# EAGLE design Mainboard (EAGLE 7.3.0)
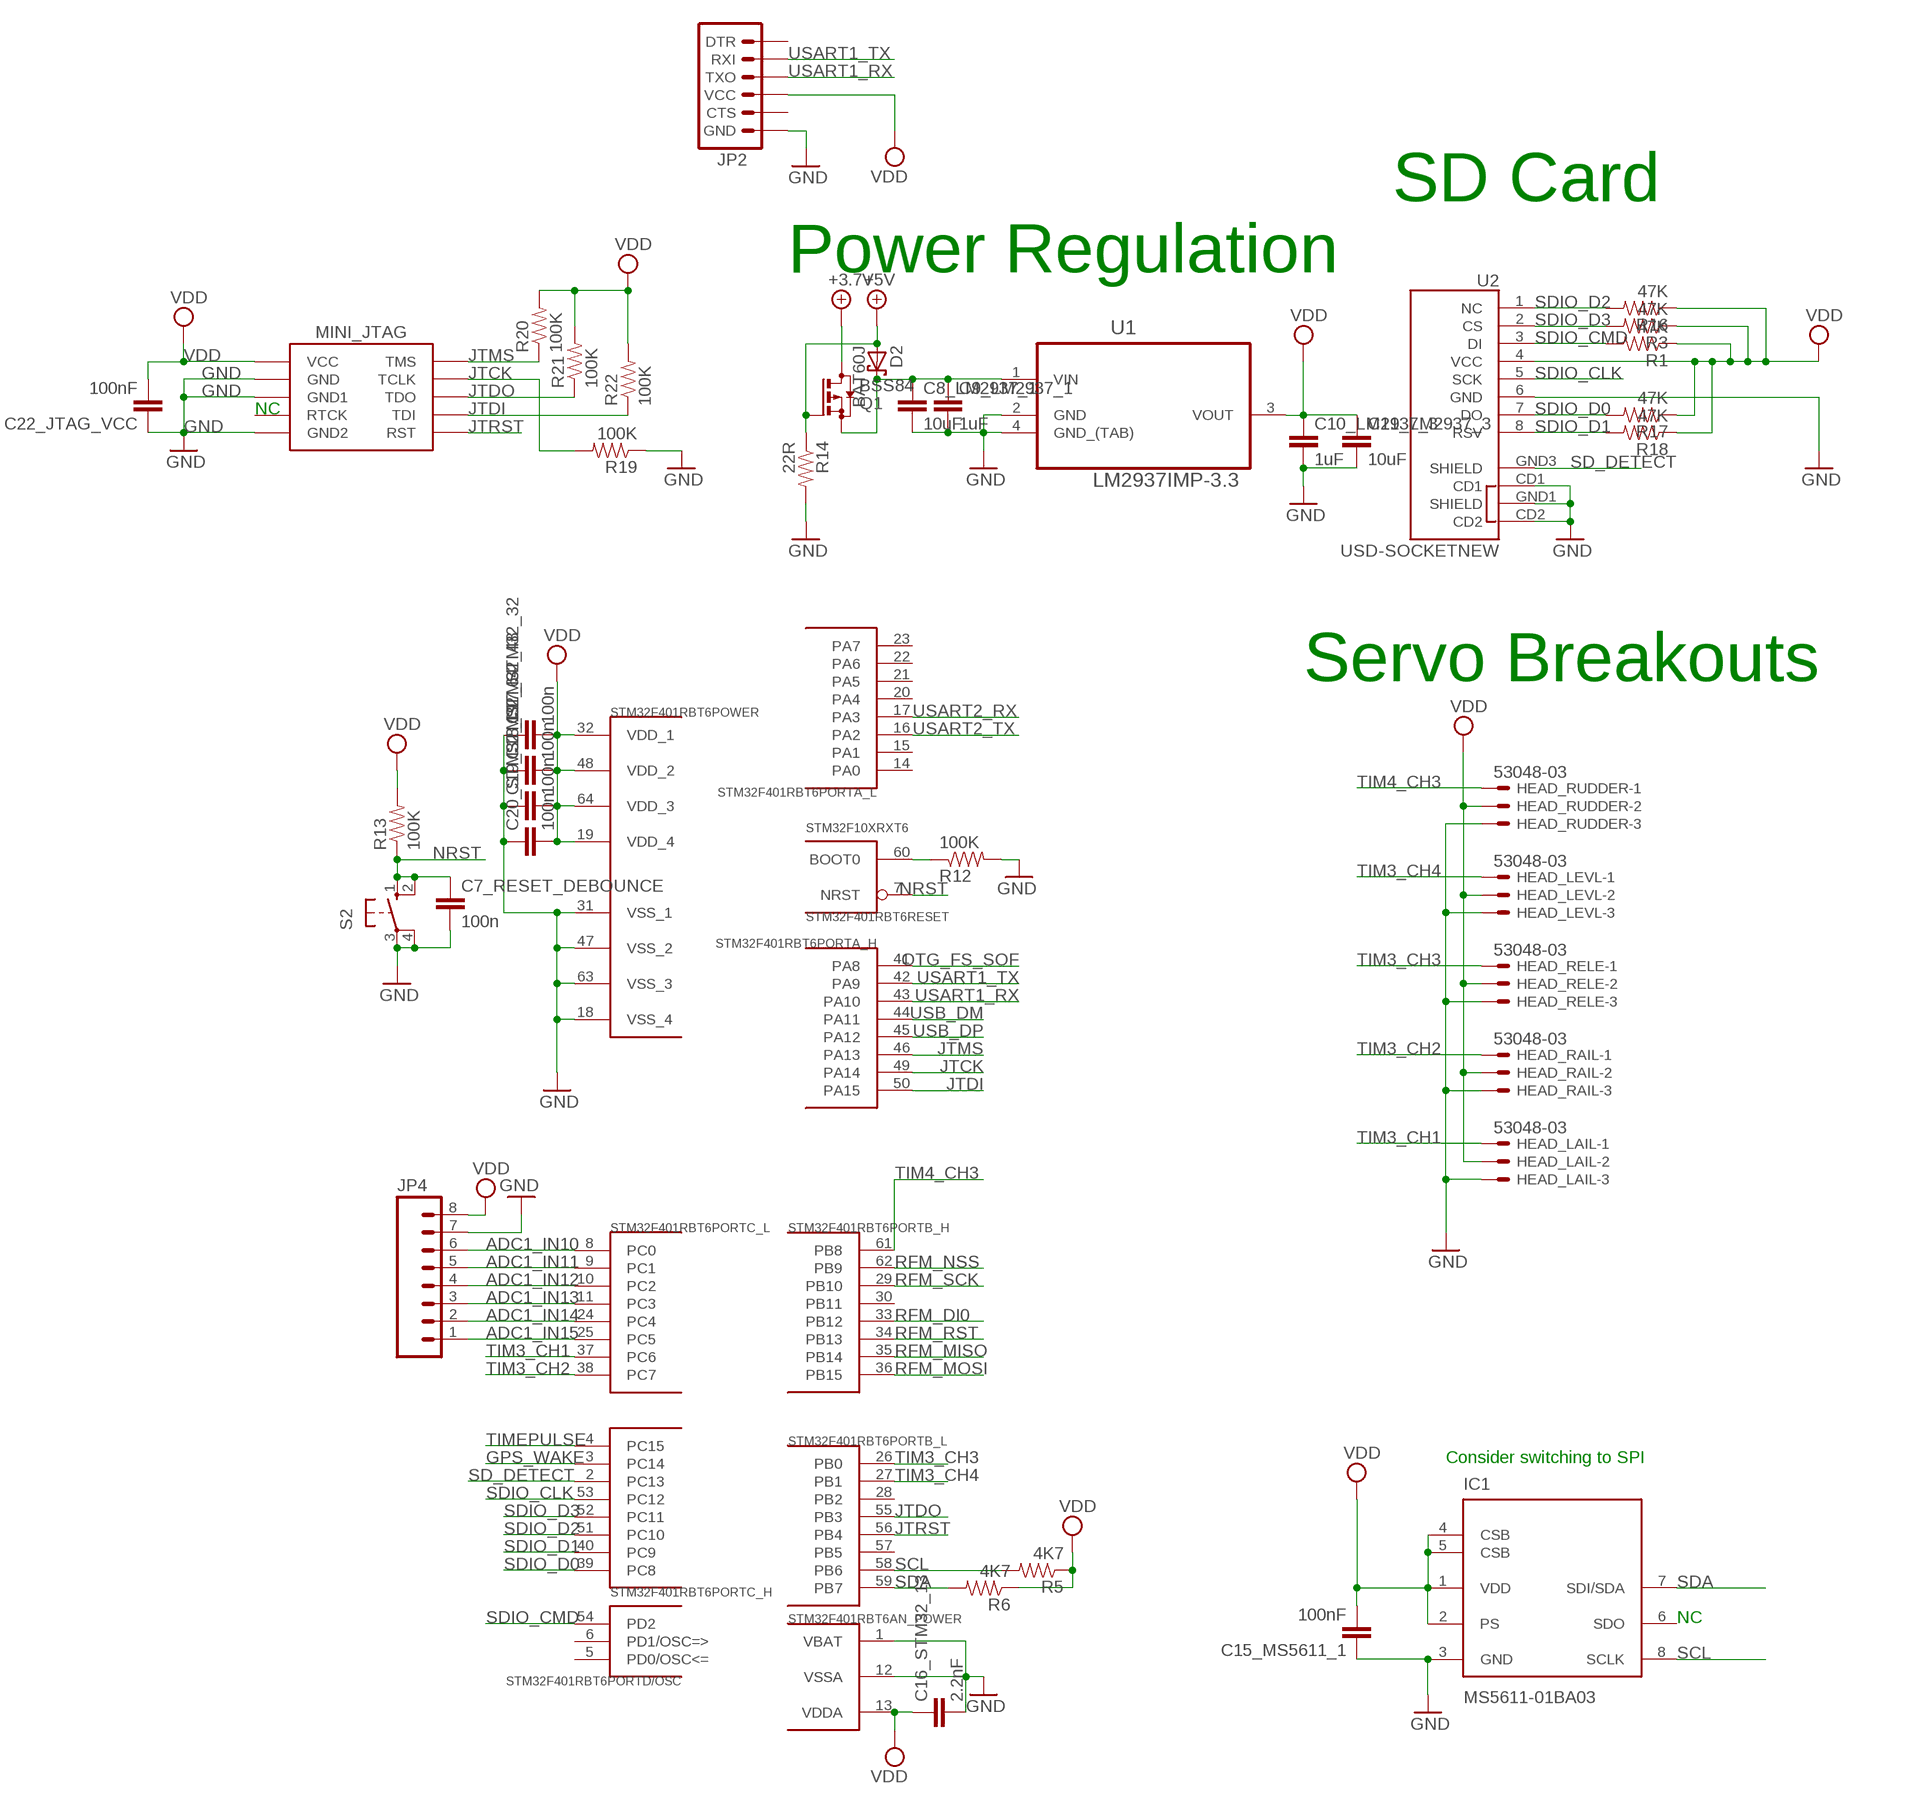
[diagram p0: schematic, sheet 1, part 1 of 2]
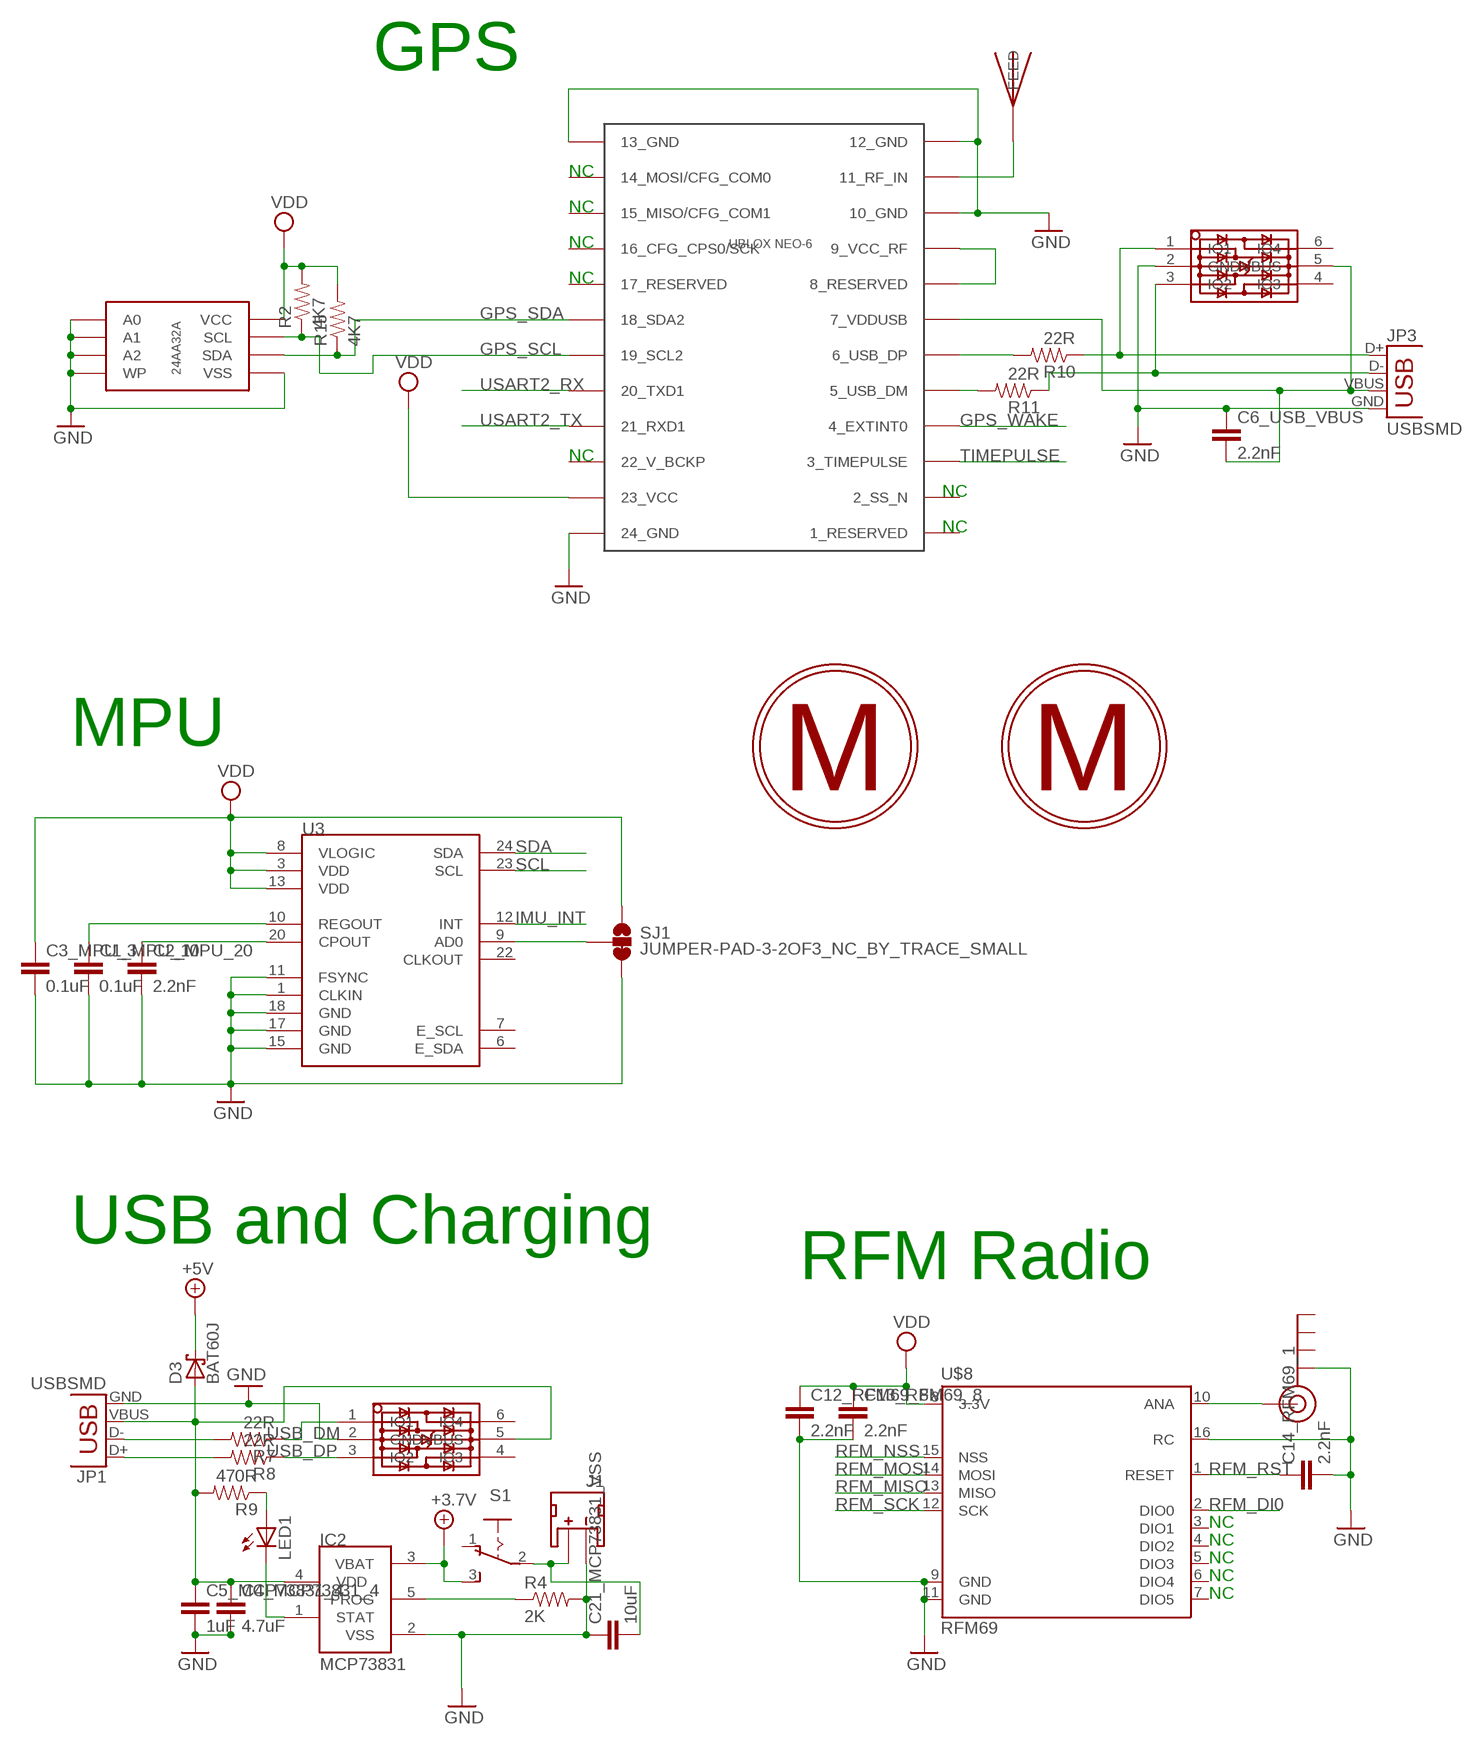
[diagram p1: schematic, sheet 1, part 2 of 2]

## Parts
C1_MPU_10  0.1uF  CAP0805  [0805]
C2_MPU_20  2.2nF  CAP0805  [0805]
C3_MPU_3  0.1uF  CAP0805  [0805]
C4_MCP73831_4  4.7uF  CAP0805  [0805]
C5_MCP73831_4  1uF  CAP0805  [0805]
C6_USB_VBUS  2.2nF  CAP0805  [0805]
C7_RESET_DEBOUNCE  100n  CAP0805  [0805]
C8_LM2937_1  10uF  CAP0805  [0805]
C9_LM2937_1  1uF  CAP0805  [0805]
C10_LM2937_3  1uF  CAP0805  [0805]
C11_LM2937_3  10uF  CAP0805  [0805]
C12_RFM69_8  2.2nF  CAP0805  [0805]
C13_RFM69_8  2.2nF  CAP0805  [0805]
C14_RFM69_1  2.2nF  CAP0805  [0805]
C15_MS5611_1  100nF  CAP0805  [0805]
C16_STM32_13  2.2nF  CAP0805  [0805]
C17_STM32_32  100n  CAP0805  [0805]
C18_STM32_48  100n  CAP0805  [0805]
C19_STM32_64  100n  CAP0805  [0805]
C20_STM32_19  100n  CAP0805  [0805]
C21_MCP73831_VSS  10uF  CAP0805  [0805]
C22_JTAG_VCC  100nF  CAP0805  [0805]
D2  BAT60J  [SOD323_ST]
D3  BAT60J  [SOD323_ST]
HEAD_LAIL  53048-03  [53048-03]
HEAD_LEVL  53048-03  [53048-03]
HEAD_RAIL  53048-03  [53048-03]
HEAD_RELE  53048-03  [53048-03]
HEAD_RUDDER  53048-03  [53048-03]
IC1  MS5611-01BA03  [SON125P300X500X100-8N]
IC2  MCP73831  [SOT23-5L]
J1  JST_2MM_MALE  [JST-2-SMD]
J$1  SMA_EDGE  [SMA-EDGE]
JP1  USBSMD  [USB-MINIB]
JP2  ARDUINO_SERIAL_PROGRAMSMD  [1X06-SMD]
JP3  USBSMD  [USB-MINIB]
JP4  M08BM08B-SRSS-TB  [BM08B-SRSS-TB]
LED1  LEDCHIP-LED0805  [CHIP-LED0805]
Q1  BSS84  [SOT23]
R1  47K  RESISTOR0805-RES  [0805]
R2  4K7  RESISTOR0805-RES  [0805]
R3  47K  RESISTOR0805-RES  [0805]
R4  2K  RESISTOR0805-RES  [0805]
R5  4K7  RESISTOR0805-RES  [0805]
R6  4K7  RESISTOR0805-RES  [0805]
R7  22R  RESISTOR0805-RES  [0805]
R8  22R  RESISTOR0805-RES  [0805]
R9  470R  RESISTOR0805-RES  [0805]
R10  22R  RESISTOR0805-RES  [0805]
R11  22R  RESISTOR0805-RES  [0805]
R12  100K  RESISTOR0805-RES  [0805]
R13  100K  RESISTOR0805-RES  [0805]
R14  22R  RESISTOR0805-RES  [0805]
R15  4K7  RESISTOR0805-RES  [0805]
R16  47K  RESISTOR0805-RES  [0805]
R17  47K  RESISTOR0805-RES  [0805]
R18  47K  RESISTOR0805-RES  [0805]
R19  100K  RESISTOR0805-RES  [0805]
R20  100K  RESISTOR0805-RES  [0805]
R21  100K  RESISTOR0805-RES  [0805]
R22  100K  RESISTOR0805-RES  [0805]
S1  255SB  [255SB]
S2  10-XX  [B3F-10XX]
SJ1  JUMPER-PAD-3-2OF3_NC_BY_TRACE_SMALL  [PAD-JUMPER-3-2OF3_NC_BY_TRACE_YES_SILK_FULL_BOX]
STM32F401RBT6  STM32F10XRXT6  [TQFP64]
U1  LM2937IMP-3.3  LM2937IMP-5.0  [SOT230P700X180-4N]
U2  USD-SOCKETNEW  [MICRO-SD-SOCKET-PP]
U3  MPU-9150QFN-24-NP  [QFN-24-NP]
U$1  USBLC6-4  [SOT23-6]
U$2  JTAG_MINI  [JTAG_MINI]
U$3  I2C_EEPROM_24AA32A  [MSOP8]
U$4  JTI_ANTENNA-1575AT43A40  [JTI_ANTENNA-1575AT43A40]
U$5  UBLOX_NEO-6  [UBLOX_NEO-6P]
U$6  USBLC6-4  [SOT23-6]
U$7  SERVO  [HK3D-1.7L]
U$8  RFM69  [RFM69SMD]
U$9  SERVO  [HK3D-1.7L]

## Nets
+4.1V: IC2.3(VBAT) Q1.3(D) S1.3(S) ; supply symbol labelled +3.7V
+5V: D2.A D3.C Q1.1(G) R14.1
ADC1_IN10: JP4.6 STM32F401RBT6.8(PORTC_L:PC0)
ADC1_IN11: JP4.5 STM32F401RBT6.9(PORTC_L:PC1)
ADC1_IN12: JP4.4 STM32F401RBT6.10(PORTC_L:PC2)
ADC1_IN13: JP4.3 STM32F401RBT6.11(PORTC_L:PC3)
ADC1_IN14: JP4.2 STM32F401RBT6.24(PORTC_L:PC4)
ADC1_IN15: JP4.1 STM32F401RBT6.25(PORTC_L:PC5)
GND: C1_MPU_10.2 C2_MPU_20.2 C3_MPU_3.2 C4_MCP73831_4.2 C5_MCP73831_4.2 C6_USB_VBUS.1 C7_RESET_DEBOUNCE.2 C8_LM2937_1.2 C9_LM2937_1.2 C10_LM2937_3.2 C11_LM2937_3.2 C12_RFM69_8.2 C13_RFM69_8.2 C14_RFM69_1.2 C15_MS5611_1.1 C16_STM32_13.2 C17_STM32_32.1 C18_STM32_48.1 C19_STM32_64.1 C20_STM32_19.1 C21_MCP73831_VSS.1 C22_JTAG_VCC.1 HEAD_LAIL.3 HEAD_LEVL.3 HEAD_RAIL.3 HEAD_RELE.3 HEAD_RUDDER.3 IC1.3(GND) IC2.2(VSS) J1.1(-) J$1.GND@0(GND) JP1.GND JP2.6(GND) JP3.GND JP4.7 R4.2 R12.2 R14.2 R19.1 S2.3(P) S2.4(P1) SJ1.3 STM32F401RBT6.1(AN_POWER:VBAT) STM32F401RBT6.12(AN_POWER:VSSA) STM32F401RBT6.18(POWER:VSS_4) STM32F401RBT6.31(POWER:VSS_1) STM32F401RBT6.47(POWER:VSS_2) STM32F401RBT6.63(POWER:VSS_3) U1.2(GND) U1.4(GND_(TAB)) U2.6(GND) U2.CD1 U2.CD2 U2.GND1(SHIELD) U3.1(CLKIN) U3.11(FSYNC) U3.15(GND) U3.17(GND) U3.18(GND) U$1.2(GND) U$2.3(GND) U$2.5(GND1) U$2.9(GND2) U$3.1(A0) U$3.2(A1) U$3.3(A2) U$3.4(VSS) U$3.7(WP) U$5.10_GND U$5.12_GND U$5.13_GND U$5.24_GND U$6.2(GND) U$8.9(GND) U$8.11(GND) U$8.16(RC)
GPS_SCL: R2.1 U$3.6(SCL) U$5.19_SCL2
GPS_SDA: R15.1 U$3.5(SDA) U$5.18_SDA2
GPS_WAKE: STM32F401RBT6.3(PORTC_H:PC14) U$5.4_EXTINT0
IMU_INT: U3.12(INT)
JTCK: R19.2 STM32F401RBT6.49(PORTA_H:PA14) U$2.4(TCLK)
JTDI: R22.1 STM32F401RBT6.50(PORTA_H:PA15) U$2.8(TDI)
JTDO: R21.1 STM32F401RBT6.55(PORTB_L:PB3) U$2.6(TDO)
JTMS: R20.1 STM32F401RBT6.46(PORTA_H:PA13) U$2.2(TMS)
JTRST: STM32F401RBT6.56(PORTB_L:PB4) U$2.10(RST)
N$1: C4_MCP73831_4.1 C5_MCP73831_4.1 D3.A IC2.4(VDD) JP1.VBUS R9.2 U$6.5(VBUS)
N$2: C21_MCP73831_VSS.2 J1.2(+) S1.2(P)
N$5: J$1.SIG(SIGNAL) U$8.10(ANA)
N$13: C8_LM2937_1.1 C9_LM2937_1.1 D2.C Q1.2(S) U1.1(VIN)
N$14: U$4.FEED U$5.11_RF_IN
N$15: SJ1.2 U3.9(AD0)
N$16: JP1.D+ R8.2
N$17: JP1.D- R7.2
N$18: C1_MPU_10.1 U3.10(REGOUT)
N$19: IC2.5(PROG) R4.1
N$21: C2_MPU_20.1 U3.20(CPOUT)
N$22: LED1.A R9.1
N$23: IC2.1(STAT) LED1.C
N$24: JP3.D+ R10.1 U$1.1(IO1)
N$25: JP3.D- R11.1 U$1.3(IO2)
N$26: R10.2 U$5.6_USB_DP
N$27: R11.2 U$5.5_USB_DM
N$28: C6_USB_VBUS.2 JP3.VBUS U$1.5(VBUS) U$5.7_VDDUSB
N$30: U$5.8_RESERVED U$5.9_VCC_RF
N$31: R12.1 STM32F401RBT6.60(RESET:BOOT0)
NRST: C7_RESET_DEBOUNCE.1 R13.1 S2.1(S) S2.2(S1) STM32F401RBT6.7(RESET:NRST)
OTG_FS_SOF: STM32F401RBT6.41(PORTA_H:PA8)
RFM_DI0: STM32F401RBT6.33(PORTB_H:PB12) U$8.2(DIO0)
RFM_MISO: STM32F401RBT6.35(PORTB_H:PB14) U$8.13(MISO)
RFM_MOSI: STM32F401RBT6.36(PORTB_H:PB15) U$8.14(MOSI)
RFM_NSS: STM32F401RBT6.62(PORTB_H:PB9) U$8.15(NSS)
RFM_RST: C14_RFM69_1.1 STM32F401RBT6.34(PORTB_H:PB13) U$8.1(RESET)
RFM_SCK: STM32F401RBT6.29(PORTB_H:PB10) U$8.12(SCK)
SCL: IC1.8(SCLK) R5.2 STM32F401RBT6.58(PORTB_L:PB6) U3.23(SCL)
SD_DETECT: STM32F401RBT6.2(PORTC_H:PC13) U2.GND3(SHIELD)
SDA: IC1.7(SDI/SDA) R6.2 STM32F401RBT6.59(PORTB_L:PB7) U3.24(SDA)
SDIO_CLK: STM32F401RBT6.53(PORTC_H:PC12) U2.5(SCK)
SDIO_CMD: R1.2 STM32F401RBT6.54(PORTD/OSC:PD2) U2.3(DI)
SDIO_D0: R17.2 STM32F401RBT6.39(PORTC_H:PC8) U2.7(DO)
SDIO_D1: R18.2 STM32F401RBT6.40(PORTC_H:PC9) U2.8(RSV)
SDIO_D2: R16.2 STM32F401RBT6.51(PORTC_H:PC10) U2.1(NC)
SDIO_D3: R3.2 STM32F401RBT6.52(PORTC_H:PC11) U2.2(CS)
TIM3_CH1: HEAD_LAIL.1 STM32F401RBT6.37(PORTC_L:PC6)
TIM3_CH2: HEAD_RAIL.1 STM32F401RBT6.38(PORTC_L:PC7)
TIM3_CH3: HEAD_RELE.1 STM32F401RBT6.26(PORTB_L:PB0)
TIM3_CH4: HEAD_LEVL.1 STM32F401RBT6.27(PORTB_L:PB1)
TIM4_CH3: HEAD_RUDDER.1 STM32F401RBT6.61(PORTB_H:PB8)
TIMEPULSE: STM32F401RBT6.4(PORTC_H:PC15) U$5.3_TIMEPULSE
USART1_RX: JP2.3(TXO) STM32F401RBT6.43(PORTA_H:PA10)
USART1_TX: JP2.2(RXI) STM32F401RBT6.42(PORTA_H:PA9)
USART2_RX: STM32F401RBT6.17(PORTA_L:PA3) U$5.20_TXD1
USART2_TX: STM32F401RBT6.16(PORTA_L:PA2) U$5.21_RXD1
USB_DM: R7.1 STM32F401RBT6.44(PORTA_H:PA11) U$6.1(IO1)
USB_DP: R8.1 STM32F401RBT6.45(PORTA_H:PA12) U$6.3(IO2)
VDD: C3_MPU_3.1 C10_LM2937_3.1 C11_LM2937_3.1 C12_RFM69_8.1 C13_RFM69_8.1 C15_MS5611_1.2 C16_STM32_13.1 C17_STM32_32.2 C18_STM32_48.2 C19_STM32_64.2 C20_STM32_19.2 C22_JTAG_VCC.2 HEAD_LAIL.2 HEAD_LEVL.2 HEAD_RAIL.2 HEAD_RELE.2 HEAD_RUDDER.2 IC1.1(VDD) IC1.2(PS) IC1.4(CSB) IC1.5(CSB) JP2.4(VCC) JP4.8 R1.1 R2.2 R3.1 R5.1 R6.1 R13.2 R15.2 R16.1 R17.1 R18.1 R20.2 R21.2 R22.2 SJ1.1 STM32F401RBT6.13(AN_POWER:VDDA) STM32F401RBT6.19(POWER:VDD_4) STM32F401RBT6.32(POWER:VDD_1) STM32F401RBT6.48(POWER:VDD_2) STM32F401RBT6.64(POWER:VDD_3) U1.3(VOUT) U2.4(VCC) U3.3(VDD) U3.8(VLOGIC) U3.13(VDD) U$2.1(VCC) U$3.8(VCC) U$5.23_VCC U$8.8(3.3V)
Unconnected: IC1.6(SDO) J1.NC1(PAD1) J1.NC2(PAD2) J$1.GND@1(GND) J$1.GND@2(GND) J$1.GND@3(GND) JP2.1(DTR) JP2.5(CTS) S1.1(O) STM32F401RBT6.5(PORTD/OSC:PD0/OSC<=) STM32F401RBT6.6(PORTD/OSC:PD1/OSC=>) STM32F401RBT6.14(PORTA_L:PA0) STM32F401RBT6.15(PORTA_L:PA1) STM32F401RBT6.20(PORTA_L:PA4) STM32F401RBT6.21(PORTA_L:PA5) STM32F401RBT6.22(PORTA_L:PA6) STM32F401RBT6.23(PORTA_L:PA7) STM32F401RBT6.28(PORTB_L:PB2) STM32F401RBT6.30(PORTB_H:PB11) STM32F401RBT6.57(PORTB_L:PB5) U3.6(E_SDA) U3.7(E_SCL) U3.22(CLKOUT) U$1.4(IO3) U$1.6(IO4) U$2.7(RTCK) U$5.1_RESERVED U$5.2_SS_N U$5.14_MOSI/CFG_COM0 U$5.15_MISO/CFG_COM1 U$5.16_CFG_CPS0/SCK U$5.17_RESERVED U$5.22_V_BCKP U$6.4(IO3) U$6.6(IO4) U$8.3(DIO1) U$8.4(DIO2) U$8.5(DIO3) U$8.6(DIO4) U$8.7(DIO5)

## Notes on the sheet
- GPS
- NC
- SD Card
- NC
- NC
- Power Regulation
- NC
- NC
- NC
- NC
- NC
- Servo Breakouts
- MPU
- USB and Charging
- RFM Radio
- Consider switching to SPI
- NC
- NC
- NC
- NC
- NC
- NC

## Library data of the parts
C1_MPU_10 C2_MPU_20 C3_MPU_3 C4_MCP73831_4 C5_MCP73831_4 C6_USB_VBUS C7_RESET_DEBOUNCE C8_LM2937_1 C9_LM2937_1 C10_LM2937_3 C11_LM2937_3 C12_RFM69_8 C13_RFM69_8 C14_RFM69_1 C15_MS5611_1 C16_STM32_13 C17_STM32_32 C18_STM32_48 C19_STM32_64 C20_STM32_19 C21_MCP73831_VSS C22_JTAG_VCC = SparkFun-Capacitors:CAP: Capacitor Standard 0603 ceramic capacitor, and 0.1" leaded capacitor.
D2 D3 = diode:BAT60J: Schottky barrier diode Source: www.st.com, BAT60J.pdf
HEAD_LAIL HEAD_LEVL HEAD_RAIL HEAD_RELE HEAD_RUDDER = con-molex:53?-03: CONNECTOR wire to board 1.25 mm (.049 inch) pitch header; MF: WALDOM/MOLEX; MPN: 53048-0310; OC_FARNELL: 9732918; OC_NEWARK: 38C9908
IC1 = Measurement-Specialties:MS5611-01BA03: Variometer Module, with stainless steel cap
IC2 = microchip-update-2:MCP73831: Miniature Single-Cell, Fully Integrated Li-Ion, Li-Polymer Charge Management Controllers
J1 = SparkFun-Connectors:JST_2MM_MALE: Mates to single-cell LiPo batteries. CONN-11443 Now with smashable polarity marks!; BTM_NEG: -; BTM_POS: +; PROD_ID: CONN-11443; TOP_NEG: -; TOP_POS: +
J$1 = SparkFun-Connectors:SMA_EDGE: SMA Antenna Connector End launch SMA connector. The paste layer has been removed so that the connector can be hand soldered onto the board after reflow.
JP1 JP3 = SparkFun-Connectors:USB: USB Connectors USB-B-PTH is fully proven SKU : PRT-00139/CONN-08278 USB-miniB is fully proven SKU : PRT-00587 USB-A-PCB is untested. USB-A-H is throughly reviewed, but untested. Spark Fun Electronics SKU : PRT-00437 USB-B-SMT is throughly reviewed, but untested. Needs silkscreen touching up. USB-A-S has not been used/tested USB-MB-H has not been used/tested USB-MICROB has been used. CONN-09505; PROD_ID: CONN-08193
JP2 = SparkFun-Connectors:ARDUINO_SERIAL_PROGRAM: FTDI connector footprints; PROD_ID: CONN-08971
JP4 = SparkFun-Connectors:M08: Header 8 Standard 8-pin 0.1" header. Use with straight break away headers (SKU : PRT-00116), right angle break away headers (PRT-00553), swiss pins (PRT-00743), machine pins (PRT-00117), and female headers (PRT-00115).
LED1 = led:LED: LED OSRAM: - CHIPLED LG R971, LG N971, LY N971, LG Q971, LY Q971, LO R971, LY R971 LH N974, LH R974 LS Q976, LO Q976, LY Q976 LO Q996 - Hyper CHIPLED LW Q18S LB Q993, LB Q99A, LB R99A - SideLED LS A670, LO A670, LY A670, LG A670, LP A670 LB A673, LV A673, LT A673, LW A673 LH A674 LY A675 LS A676, LA A676, LO A676, LY A676, LW A676 LS A679, LY A679, LG A679 - Hyper Micro SIDELED® LS Y876, LA Y876, LO Y876, LY Y876 LT Y87S - SmartLED LW L88C, LW L88S LB L89C, LB L89S, LG L890 LS L89K, LO L89K, LY L89K LS L896, LA L896, LO L896, LY L896 - TOPLED LS T670, LO T670, LY T670, LG T670, LP T670 LSG T670, LSP T670, LSY T670, LOP T670, LYG T670 LG T671, LOG T671, LSG T671 LB T673, LV T673, LT T673, LW T673 LH T674 LS T676, LA T676, LO T676, LY T676, LB T676, LH T676, LSB T676, LW T676 LB T67C, LV T67C, LT T67C, LS T67K, LO T67K, LY T67K, LW E67C LS E67B, LA E67B, LO E67B, LY E67B, LB E67C, LV E67C, LT E67C LW T67C LS T679, LY T679, LG T679 LS T770, LO T770, LY T770, LG T770, LP T770 LB T773, LV T773, LT T773, LW T773 LH T774 LS E675, LA E675, LY E675, LS T675 LS T776, LA T776, LO T776, LY T776, LB T776 LHGB T686 LT T68C, LB T68C - Hyper Mini TOPLED® LB M676 - Mini TOPLED Santana® LG M470 LS M47K, LO M47K, LY M47K Source: http://www.osram.convergy.de LUXEON: - LUMILED® LXK2-PW12-R00, LXK2-PW12-S00, LXK2-PW14-U00, LXK2-PW14-V00 LXK2-PM12-R00, LXK2-PM12-S00, LXK2-PM14-U00 LXK2-PE12-Q00, LXK2-PE12-R00, LXK2-PE12-S00, LXK2-PE14-T00, LXK2-PE14-U00 LXK2-PB12-K00, LXK2-PB12-L00, LXK2-PB12-M00, LXK2-PB14-N00, LXK2-PB14-P00, LXK2-PB14-Q00 LXK2-PR12-L00, LXK2-PR12-M00, LXK2-PR14-Q00, LXK2-PR14-R00 LXK2-PD12-Q00, LXK2-PD12-R00, LXK2-PD12-S00 LXK2-PH12-R00, LXK2-PH12-S00 LXK2-PL12-P00, LXK2-PL12-Q00, LXK2-PL12-R00 Source: www.luxeon.com KINGBRIGHT: KA-3528ASYC Source: www.kingbright.com
Q1 = transistor-small-signal:BSS84: P-CHANNEL MOS FET
R1-R22 = SparkFun-Passives:RESISTOR: Resistor Basic schematic elements and footprints for 0603, 1206, and PTH resistors.
S1 = switch:255SB: SLIDING SWITCH Distributor Buerklin, 11G810
S2 = switch-omron:10-XX: OMRON SWITCH; MPN: B3F-1000; OC_FARNELL: 176432; OC_NEWARK: 36M3542
SJ1 = SparkFun-Passives:JUMPER-PAD-3-2OF3_NC_BY_TRACE
STM32F401RBT6 = stm32:STM32F10XRXT6: STM32F101/103 64pin LQFP
U1 = Ava:LM2937IMP-5.0: IC, LDO VOLT REG, 5V, 0.5A; MPN: LM2937IMP-5.0; OC_FARNELL: 1798318; OC_NEWARK: 83F3856; PACKAGE: SOT-223-3; SUPPLIER: Microchip
U2 = SparkFun-Connectors:USD-SOCKET: microSD Socket Push-push type uSD socket. Schematic element and footprint production proven. Spark Fun Electronics SKU : PRT-00127. tDoc lines correctly indicate media card edge positions when inserting (unlocked, locked, depressed). NOTE: CD1 and CD2 are connected internally; PROD_ID: CONN-07820
U3 = SparkFun-Sensors:MPU-9150: 9DOF (3mag, 3accel, 3rotat). I2C interface.
U$1 U$6 = zetex:USBLC6-4
U$2 = jonsowman:JTAG_MINI
U$3 = jonsowman:I2C_EEPROM_24AA32A
U$4 = Ava:JTI_ANTENNA-1575AT43A40
U$5 = Ava:UBLOX_NEO-6: UBLOX NEO-6 GPS MODULE Author Anthony Stirk / http://ava.upuaut.net http://www.u-blox.com/images/downloads/Product_Docs/LEA-6_NEO-6_MAX_HardwareIntegrationManual_%28GPS.G6-HW-09007%29.pdf http://www.u-blox.com/images/downloads/Product_Docs/NEO-6_DataSheet_%28GPS.G6-HW-09005%29.pdf
U$7 U$9 = b3noxley:SERVO
U$8 = SWP:RFM69

## Board
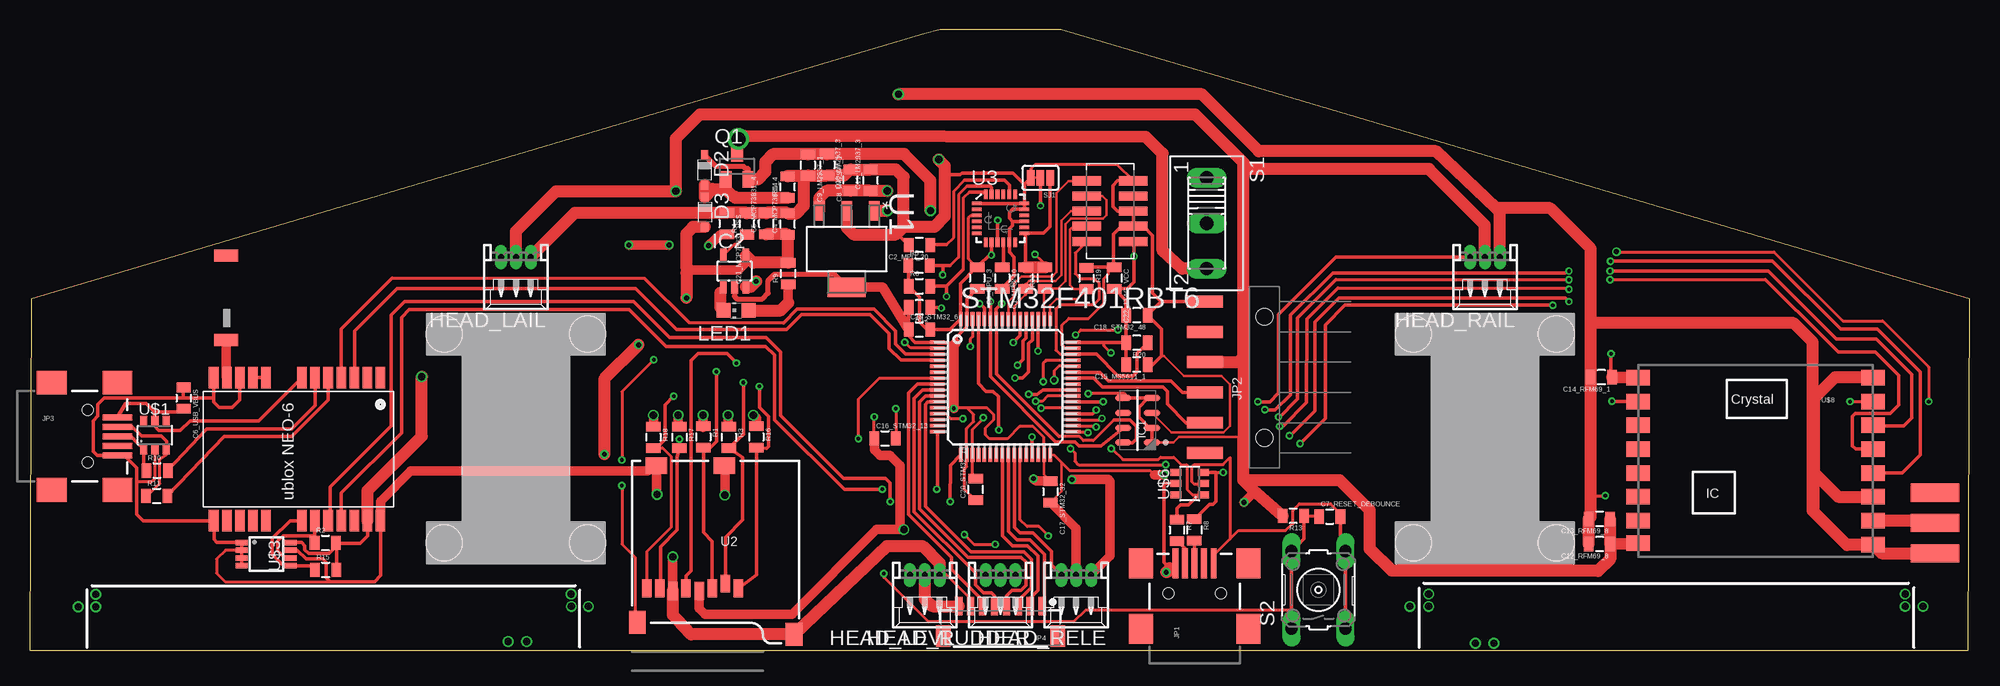
[diagram p2: board, top side]
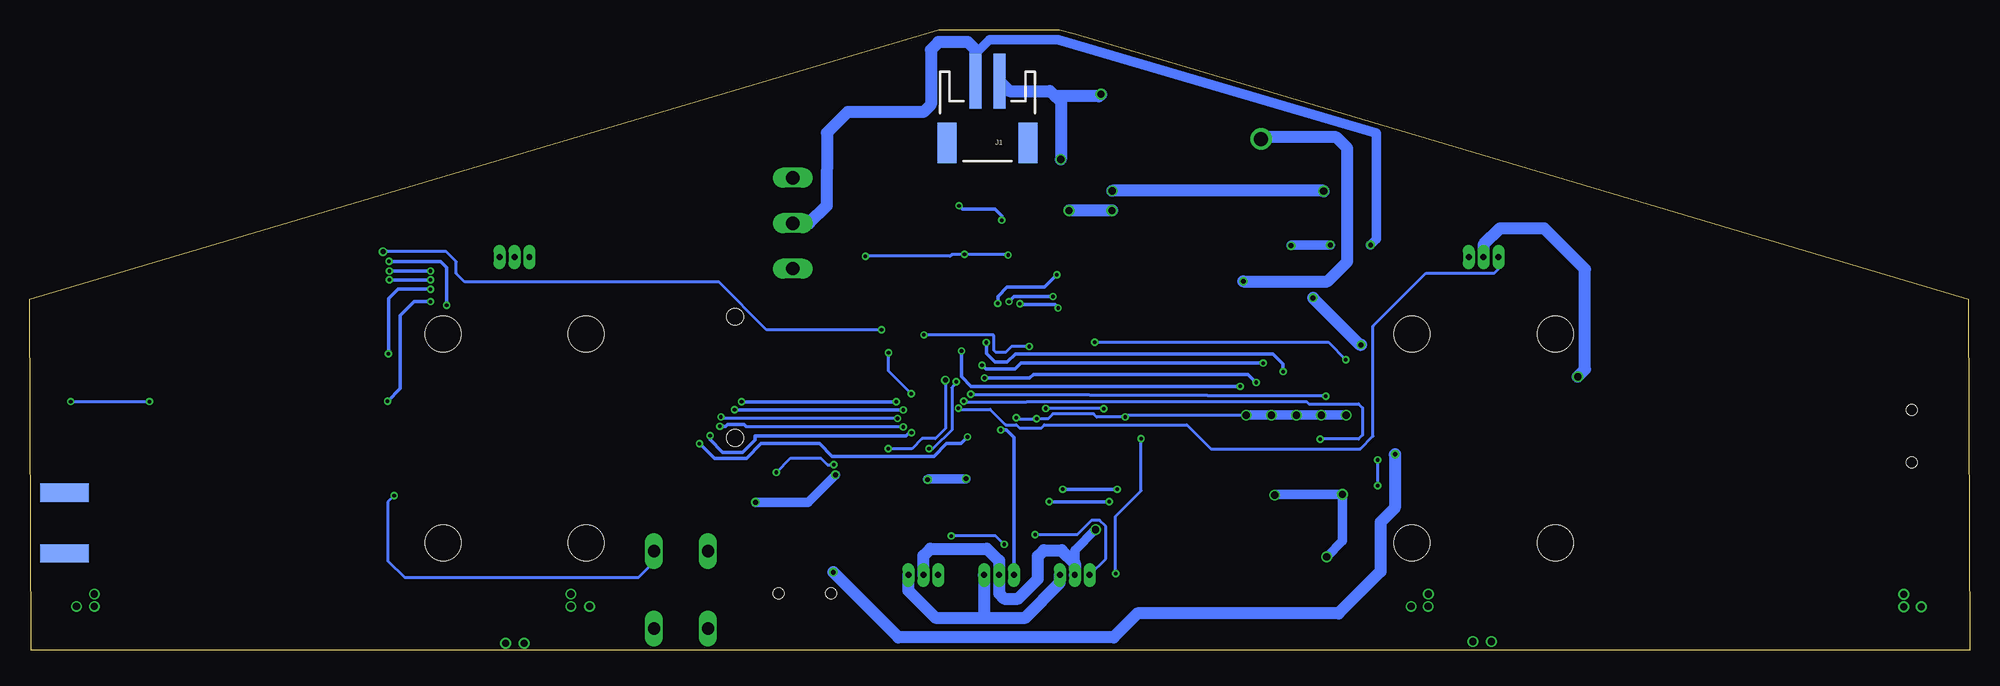
[diagram p3: board, bottom side, seen from below]

Size 162.69 x 52.07 mm. Coordinates in mm from the lower left corner, seen from the top.
Outline: 0,0 162.56,0 162.69,29.46 86.49,52.07 76.33,52.07 75.06,51.74 0.13,29.46 0,0
Copper layers (1*16): Top 0.035mm / dielectric 1.5mm / Bottom 0.035mm
Design rules "dirt_cheap_dirty_boards.v1": minimum track width 5mil, minimum drill 12mil, track to track 5mil, track to pad 5mil, pad to pad 5mil, via to via 5mil, smd to smd 0mil, copper to edge 10mil, drill to drill 10mil, minimum pad ring 10mil, minimum via ring 6mil, stop-mask expansion 2mil, vias tented up to drill 25mil, thermal gap 10mil

### Footprints (pad centres in the part's own frame; a part is rotated, then mirrored left to right if it is on the bottom)
0805 = smd 0.8 x 1.2: 1 -0.9,0; 2 0.9,0
SOD323_ST = smd 0.8 x 0.6: A 1.25,0; C -1.25,0
53048-03 = drill 0.5 pad 0.698 long: 1 1.25,-1.25; 2 0,-1.25; 3 -1.25,-1.25
SON125P300X500X100-8N = smd 1.35 x 0.55: 1 -1.2,1.875; 2 -1.2,0.625; 3 -1.2,-0.625; 4 -1.2,-1.875; 5 1.2,-1.875; 6 1.2,-0.625; 7 1.2,0.625; 8 1.2,1.875
SOT23-5L = smd 0.55 x 1.2: 1 -0.95,-1.3; 2 0,-1.3; 3 0.95,-1.3; 4 0.95,1.3; 5 -0.95,1.3
JST-2-SMD = smd 1 x 4.6: 1 -1,-3.7; 2 1,-3.7 | smd 1.6 x 3.4: NC1 -3.4,1.5; NC2 3.4,1.5
SMA-EDGE = smd 1.524 x 4.064: GND@0 0,0; GND@1 5.08,0; SIG 2.54,0 | smd 1.524 x 4.064 bottom: GND@2 0,0; GND@3 5.08,0
USB-MINIB = smd 2.5 x 0.5: D+ 2.5,0; D- 2.5,0.8; GND 2.5,-1.6; ID 2.5,-0.8; VBUS 2.5,1.6 | smd 2.5 x 2: MTN1 -3,4.5; MTN2 2.5,4.5; MTN3 -3,-4.5; MTN4 2.5,-4.5 | hole 0.9: 0,2.2; 0,-2.2
1X06-SMD = smd 1 x 3: 1 -6.35,5; 2 -3.81,5; 3 -1.27,5; 4 1.27,5; 5 3.81,5; 6 6.35,5 | hole 1.4: -5.08,0; 5.08,0
BM08B-SRSS-TB = smd 0.6 x 1.55: 1 -3.5,0; 2 -2.5,0; 3 -1.5,0; 4 -0.5,0; 5 0.5,0; 6 1.5,0; 7 2.5,0; 8 3.5,0 | smd 1.2 x 1.8: P$9 4.8,2.525; P$10 -4.8,2.525
CHIP-LED0805 = smd 1.2 x 1.2: A 0,-1.05; C 0,1.05
SOT23 = smd 1 x 1.4: 1 -0.95,-1.1; 2 0.95,-1.1; 3 0,1.1
255SB = drill 1.118 long: 1 -3.81,0; 2 0,0; 3 3.81,0
B3F-10XX = drill 1.016 long: 1 -3.251,2.261; 2 3.251,2.261; 3 -3.251,-2.261; 4 3.251,-2.261
PAD-JUMPER-3-2OF3_NC_BY_TRACE_YES_SILK_FULL_BOX = smd 0.635 x 1.27: 1 -0.813,0; 2 0,0; 3 0.813,0
TQFP64 = smd 1.2 x 0.3: 1 -5.7,3.75; 2 -5.7,3.25; 3 -5.7,2.75; 4 -5.7,2.25; 5 -5.7,1.75; 6 -5.7,1.25; 7 -5.7,0.75; 8 -5.7,0.25; 9 -5.7,-0.25; 10 -5.7,-0.75; 11 -5.7,-1.25; 12 -5.7,-1.75; 13 -5.7,-2.25; 14 -5.7,-2.75; 15 -5.7,-3.25; 16 -5.7,-3.75; 33 5.7,-3.75; 34 5.7,-3.25; 35 5.7,-2.75; 36 5.7,-2.25; 37 5.7,-1.75; 38 5.7,-1.25; 39 5.7,-0.75; 40 5.7,-0.25; 41 5.7,0.25; 42 5.7,0.75; 43 5.7,1.25; 44 5.7,1.75; 45 5.7,2.25; 46 5.7,2.75; 47 5.7,3.25; 48 5.7,3.75 | smd 0.3 x 1.2: 17 -3.75,-5.7; 18 -3.25,-5.7; 19 -2.75,-5.7; 20 -2.25,-5.7; 21 -1.75,-5.7; 22 -1.25,-5.7; 23 -0.75,-5.7; 24 -0.25,-5.7; 25 0.25,-5.7; 26 0.75,-5.7; 27 1.25,-5.7; 28 1.75,-5.7; 29 2.25,-5.7; 30 2.75,-5.7; 31 3.25,-5.7; 32 3.75,-5.7; 49 3.75,5.7; 50 3.25,5.7; 51 2.75,5.7; 52 2.25,5.7; 53 1.75,5.7; 54 1.25,5.7; 55 0.75,5.7; 56 0.25,5.7; 57 -0.25,5.7; 58 -0.75,5.7; 59 -1.25,5.7; 60 -1.75,5.7; 61 -2.25,5.7; 62 -2.75,5.7; 63 -3.25,5.7; 64 -3.75,5.7
SOT230P700X180-4N = smd 1.626 x 0.889: 1 -3.2,2.311; 2 -3.2,0; 3 -3.2,-2.311 | smd 1.626 x 3.175: 4 3.2,0
MICRO-SD-SOCKET-PP = smd 0.8 x 1.5: 1 -8.94,10.7; 2 -7.84,10.3; 3 -6.74,10.7; 4 -5.64,10.9; 5 -4.54,10.7; 6 -3.44,10.9; 7 -2.34,10.7; 8 -1.24,10.7 | smd 1.8 x 1.4: CD1 -2.05,0.4; CD2 -7.75,0.4 | smd 1.4 x 1.9: GND1 -13.6,14.55; GND3 -0.45,13.55
QFN-24-NP = smd 0.8 x 0.3: 1 -2,1.25; 2 -2,0.75; 3 -2,0.25; 4 -2,-0.25; 5 -2,-0.75; 6 -2,-1.25; 13 2,-1.25; 14 2,-0.75; 15 2,-0.25; 16 2,0.25; 17 2,0.75; 18 2,1.25 | smd 0.3 x 0.8: 7 -1.25,-2; 8 -0.75,-2; 9 -0.25,-2; 10 0.25,-2; 11 0.75,-2; 12 1.25,-2; 19 1.25,2; 20 0.75,2; 21 0.25,2; 22 -0.25,2; 23 -0.75,2; 24 -1.25,2
SOT23-6 = smd 0.6 x 0.9: 1 -0.95,-1.15; 2 0,-1.15; 3 0.95,-1.15; 4 0.95,1.15; 5 0,1.15; 6 -0.95,1.15
JTAG_MINI = smd 0.76 x 2.4: 1 -2.54,-1.95; 2 -2.54,1.95; 3 -1.27,-1.95; 4 -1.27,1.95; 5 0,-1.95; 6 0,1.95; 7 1.27,-1.95; 8 1.27,1.95; 9 2.54,-1.95; 10 2.54,1.95
MSOP8 = smd 0.45 x 1: 1 -0.975,-2.05; 2 -0.325,-2.05; 3 0.325,-2.05; 4 0.975,-2.05; 5 0.975,2.05; 6 0.325,2.05; 7 -0.325,2.05; 8 -0.975,2.05
JTI_ANTENNA-1575AT43A40 = smd 1 x 2: FEED -3.175,0; NC 3.925,0
UBLOX_NEO-6P = smd 1.8 x 0.8: 1_RESERVED 6.4,-7.4; 2_SS_N 6.4,-6.3; 3_TIMEPULSE 6.4,-5.2; 4_EXTINT0 6.4,-4.1; 5_USB_DM 6.4,-3; 6_USB_DP 6.4,-1.9; 7_VDDUSB 6.4,-0.8; 8_RESERVED 6.4,2.2; 9_VCC_RF 6.4,3.3; 10_GND 6.4,4.4; 11_RF_IN 6.4,5.5; 12_GND 6.4,6.6; 13_GND -5.6,6.6; 14_MOSI/CFG_COM0 -5.6,5.5; 15_MISO/CFG_COM1 -5.6,4.4; 16_CFG_CPS0/SCK -5.6,3.3; 17_RESERVED -5.6,2.2; 18_SDA2 -5.6,-0.8; 19_SCL2 -5.6,-1.9; 20_TXD1 -5.6,-3; 21_RXD1 -5.6,-4.1; 22_V_BCKP -5.6,-5.2; 23_VCC -5.6,-6.3; 24_GND -5.6,-7.4
HK3D-1.7L = hole 3: -6,8.75; 6,8.75; 6,-8.75; -6,-8.75
RFM69SMD = smd 2 x 1.3: 1 -10.1,6.6; 2 -10.1,4.6; 3 -10.1,2.6; 4 -10.1,0.6; 5 -10.1,-1.4; 6 -10.1,-3.4; 7 -10.1,-5.4; 8 -10.1,-7.3; 9 9.6,-7.4; 10 9.6,-5.4; 11 9.6,-3.4; 12 9.6,-1.4; 13 9.6,0.6; 14 9.6,2.6; 15 9.6,4.6; 16 9.6,6.6

### Placement (x,y rotation side)
C1_MPU_10  81.56,31.24 270 top
C2_MPU_20  74.6,34.01 180 top
C3_MPU_3  79.45,31.24 270 top
C4_MCP73831_4  63.55,35.76 90 top
C5_MCP73831_4  61.77,35.81 90 top
C6_USB_VBUS  12.9,21.16 270 top
C7_RESET_DEBOUNCE  109.02,11.23 0 top
C8_LM2937_1  66.88,40.74 270 top
C9_LM2937_1  65.25,40.72 270 top
C10_LM2937_3  68.83,39.47 90 top
C11_LM2937_3  70.51,39.45 90 top
C12_RFM69_8  131.65,8.92 180 top
C13_RFM69_8  131.65,11.02 180 top
C14_RFM69_1  131.8,22.91 180 top
C15_MS5611_1  92.84,23.98 180 top
C16_STM32_13  71.73,17.78 0 top
C17_STM32_32  85.6,13.31 270 top
C18_STM32_48  92.84,28.12 180 top
C19_STM32_64  74.6,26.92 0 top
C20_STM32_19  79.32,13.51 90 top
C21_MCP73831_VSS  58.45,35.81 270 top
C22_JTAG_VCC  90.96,31.24 270 top
D2  56.59,40.31 270 top
D3  56.62,36.78 270 top
HEAD_LAIL  40.77,31.75 180 top
HEAD_LEVL  75.06,5.08 180 top
HEAD_RAIL  122.05,31.75 180 top
HEAD_RELE  87.76,5.08 180 top
HEAD_RUDDER  81.41,5.08 180 top
IC1  92.91,19.3 180 top
IC2  59.11,31.83 0 top
J1  82.37,44.07 180 bottom
J$1  159.77,8.15 90 top
JP1  97.69,4.8 90 top
JP2  103.56,22.91 90 top
JP3  4.85,17.96 0 top
JP4  81.41,3.71 180 top
LED1  59.23,28.52 90 top
Q1  59.31,40.61 0 top
R1  56.49,17.91 270 top
R2  24.79,9.02 0 top
R3  58.62,17.88 270 top
R4  60.15,35.79 90 top
R5  74.57,32.28 0 top
R6  74.6,30.56 0 top
R7  96.22,10.08 270 top
R8  97.66,10.11 270 top
R9  63.6,31.62 90 top
R10  10.67,15.09 0 top
R11  10.64,12.95 0 top
R12  74.6,28.78 180 top
R13  105.97,11.28 180 top
R14  63.55,38.89 90 top
R15  24.82,6.76 0 top
R16  60.93,17.91 270 top
R17  54.48,17.88 270 top
R18  52.3,17.88 270 top
R19  88.62,31.22 270 top
R20  92.84,25.81 180 top
R21  83.52,31.24 90 top
R22  85.14,31.24 90 top
S1  98.7,35.84 270 top
S2  108.08,5.08 90 top
SJ1  84.76,39.65 180 top
STM32F401RBT6  81.81,22.1 0 top
U1  68.5,33.68 270 top
U2  50.5,15.9 180 top
U3  81.41,36.25 0 top
U$1  10.49,18.06 0 top
U$2  90.6,36.86 90 top
U$3  19.84,8.08 270 top
U$4  16.48,29.21 90 top
U$5  22.02,16.48 90 top
U$6  97.28,14 90 top
U$7  40.77,17.78 0 top
U$8  144.98,16.28 0 top
U$9  122.05,17.78 0 top

### Tracks (layer width: path | path; a pad name or v marks a point on that pad's centre or on a via)
+4.1V  (via drill 0.41, 1.2)
  Top 1.016: S1.3 96.65,32.03 95,33.53 95,41.68 93.6,43.08 59.94,43.16 59.69,43.16 v59.44,42.9 59.31,42.77 Q1.3 | IC2.3 60.47,30.53 v60.91,30.96
  Bottom 1.016: v60.91,30.96 53.87,30.96 52.2,32.64 52.2,42.14 53.11,43.05 59.28,43.05 v59.44,42.9
+5V
  Top 1.016: Q1.1 58.36,38.71 | 58.36,38.71 58.99,38.08 59.08,38.08 59.17,37.99 R14.1 | 58.36,38.71 57.25,38.71 D3.C 56.59,38.11 D2.A
ADC1_IN10
  Top 0.305: JP4.6 79.91,4.19 79.42,4.67 78.44,5.66 77.32,6.78 77.32,7.8 73.71,11.41 73.71,21.61 74.44,22.35 STM32F401RBT6.8
ADC1_IN11
  Top 0.305: STM32F401RBT6.9 74.88,21.84 74.17,21.13 74.17,11.63 79.3,6.5 79.3,5.49 79.98,4.83 80.67,4.83 80.91,4.59 JP4.5
ADC1_IN12
  Top 0.305: JP4.4 81.91,3.56 81.91,4.57 82.37,5.03 83.11,5.03 83.54,5.46 83.54,7.42 83.13,7.82 78.66,7.82 74.62,11.86 74.62,20.85 75.12,21.35 STM32F401RBT6.10
ADC1_IN13
  Top 0.305: STM32F401RBT6.11 76.09,20.83 75.29,20.83 75.11,20.65 75.11,12.09 78.92,8.28 83.36,8.28 84.02,7.62 84.02,5.31 82.91,4.22 JP4.3
ADC1_IN14
  Top 0.305: JP4.2 83.92,3.57 83.92,4.42 84.56,5.05 84.56,7.93 83.69,8.79 82.4,8.79 81.56,9.62 STM32F401RBT6.24
ADC1_IN15
  Top 0.305: JP4.1 85.09,3.74 85.09,8.05 83.87,9.27 82.78,9.27 82.06,9.99 STM32F401RBT6.25
GND  (via drill 0.3, 0.41, 0.6, 0.6 pad 0.3)
  Top 0.203: IC1.3 95.75,18.29 100.13,18.29 100.66,18.82 100.66,22.3 99.92,23.04 96.8,23.04 95.12,24.71 94.89,24.71 | C17_STM32_32.1 85.06,14.74 STM32F401RBT6.31
  Top 0.254: U$1.2 10.49,14.4 10.16,14.12 8.97,14.12 | STM32F401RBT6.47 86.82,25.35 86.56,25.6 86.56,27.28 87.15,27.86 88.8,27.86 90.07,29.13 90.07,31.19 90.45,31.57 90.45,32.14 | STM32F401RBT6.12 77.44,20.35 v77.49,20.29 77.49,20.32 77.52,20.35 78.59,20.35 | v72.62,20.27 72.63,20.28 C16_STM32_13.2 | 78.59,20.35 79.15,19.79 79.15,19.2 78.56,18.62 STM32F401RBT6.18 78.56,15.39 78.41,15.21 78.41,13.5 C20_STM32_19.1 | STM32F401RBT6.31 85.04,16.42 85.04,17.88 84.15,18.77 83.01,18.77 81.99,17.75 80.49,17.75 80.16,18.09 80.16,18.67 80.85,19.36 80.85,19.76 80.26,20.35 78.59,20.35 | U$6.2 98.38,13.95 97.66,13.95 97.46,14.15 97.46,15.42 97.64,15.6 100.08,15.6 100.66,16.18 100.66,9.35 | 100.66,9.35 99.29,7.98 JP1.GND | 100.66,9.35 101.37,10.06 105.31,10.06 105.94,10.64 105.94,11.76 106.48,12.29 109.09,12.29 109.92,11.47 C7_RESET_DEBOUNCE.2 | 76.16,25.81 77.7,25.81 | U$2.9 91.18,40.77 84.3,40.77 83.95,40.41 SJ1.3 | C12_RFM69_8.2 130.91,9.08 130.91,12.75 131.14,12.98 v132.13,12.98 | U$3.2 16.41,8.41 15.67,7.67 15.67,6.48 16.38,5.77 25.17,5.77 | JP4.7 78.89,3.57 78.89,4.32 76.88,6.33 HEAD_LEVL.3
  Top 0.305: U$2.3 U$2.5 91.21,36.86 90.83,37.24 90.83,39.01 91.21,39.39 U$2.9 | C7_RESET_DEBOUNCE.2 109.92,8.75 S2.4 S2.3 | U$5.10_GND 17.6,22.86 17.6,21.01 16.99,20.4 15.88,20.4 15.42,20.85 15.42,21.16 | 15.42,21.16 U$5.12_GND | 12.88,21.16 6.22,21.16 5.71,20.65 5.71,19.66 5.31,19.25 5.31,16.69 5.64,16.36 6.87,16.36 JP3.GND 7.92,16.36 8.97,15.32 8.97,14.12 8.97,11.43 9.53,10.87 U$5.13_GND 15.44,10.86 15.44,9.3 15.69,9.05 U$3.1 U$3.2 U$3.3 U$3.4 | 12.88,21.16 15.42,21.16 | C6_USB_VBUS.1 12.88,22.03 12.88,21.16 | U3.18 U3.1 U3.18 83.41,39.09 82.45,40.06 78.18,40.06 78.03,39.9 76.73,39.9 | U3.18 U3.17 83.39,37.01 82.42,37.01 82.14,36.73 82.14,36.27 82.42,36 | 82.42,36 U3.15 | 82.42,36 82.42,35.66 82.17,35.41 82.17,34.26 U3.11 82.17,34.23 82.17,33.4 82.55,33.02 82.55,31.42 81.56,30.43 C1_MPU_10.2 C3_MPU_3.2 78.59,29.49 78.59,27.82 STM32F401RBT6.63 78.56,27.13 77.24,25.81 76.16,25.81 STM32F401RBT6.1 74.25,25.85 73.74,26.36 73.74,26.89 C19_STM32_64.1 R12.2 | R19.1 88.65,32.14 90.45,32.14 C22_JTAG_VCC.1 90.88,32.22 90.88,34.92 91.54,35.58 U$2.3 | C15_MS5611_1.1 93.8,23.62 94.89,24.71 94.89,26.96 C18_STM32_48.1 94.88,29.26 | 94.88,29.26 JP2.6 | C2_MPU_20.2 72.81,34.9 72.64,34.9 | SJ1.3 83.41,39.11 U3.18 | 94.88,29.26 94.16,29.98 94.16,34.82 93.4,35.58 U$2.3 | STM32F401RBT6.47 | U$3.7 22.42,8.4 22.43,8.41 23.16,7.67 24.56,7.67 24.84,7.39 24.84,6.1 25.17,5.77 28.9,5.77 29.44,6.3 29.44,10.87 U$5.24_GND
  Top 0.406: IC2.2 59.11,29.69 59.31,29.49 61.44,29.49 61.93,29.97 61.93,31.04 62.46,31.57 67.44,31.57 U1.4
  Top 0.813: C19_STM32_64.1 71.5,30.49 69.37,30.49 U1.4 | U$5.24_GND 29.42,12.5 31.95,15.04 51.82,15.04 51.9,15.12 U2.CD1 52.55,13.14 v52.6,13.08 | U2.6 53.92,4.63 v53.92,7.85 | U2.CD2 58.29,15.07 v58.29,13.03 | HEAD_RELE.3 90.6,7.93 90.6,14.17 90.45,14.33 v87.4,14.33 | v84.18,14.4 84.37,14.21 C17_STM32_32.1 | 77.7,25.81 77.49,25.6 v77.49,20.29
  Top 1.016: R14.2 63.58,39.82 C9_LM2937_1.2 | C9_LM2937_1.2 65.28,39.84 C8_LM2937_1.2 68.3,39.84 C10_LM2937_3.2 68.86,40.35 C11_LM2937_3.2 72.64,40.35 73.28,39.71 73.28,35.53 | U1.2 68.5,35.48 69.09,34.9 72.64,34.9 73.28,35.53 | C9_LM2937_1.2 64.92,39.49 64.92,37.3 64.29,36.66 C4_MCP73831_4.2 63.5,36.71 C5_MCP73831_4.2 61.75,36.69 R4.2 60.12,36.71 C21_MCP73831_VSS.1 45.73,36.71 HEAD_LAIL.3 | 73.28,35.53 75.84,35.53 76.73,36.42 76.73,39.9 76.73,40.67 76.22,41.17 v76.22,41.2 | HEAD_RAIL.3 123.29,36.78 122.97,37.1 | 122.97,37.1 117.93,41.89 103.07,41.89 98.32,46.66 v72.85,46.66 | HEAD_LEVL.3 76.31,7.31 74.85,8.76 71.89,8.76 U2.GND1 55.46,1.35 54.3,2.59 53.94,2.96 U2.6 | C12_RFM69_8.2 C13_RFM69_8.2 130.9,11.18 C14_RFM69_1.2 130.91,22.92 130.91,27.46 | 130.91,27.46 130.91,33.71 127.52,37.1 122.97,37.1 | U$8.16 154.55,22.91 151.38,22.91 149.61,21.13 149.61,14.94 | 149.61,14.94 151.66,12.88 U$8.11 | 149.61,11.63 152.4,8.84 154.54,8.84 U$8.9 155.31,8.15 J$1.GND@0 | 149.61,11.63 149.61,14.94 | 149.61,11.63 149.53,11.71 149.53,25.86 147.93,27.46 130.91,27.46
  Bottom 0.254: v77.49,20.29 77.49,20.32 77.47,20.35 72.67,20.35 72.62,20.29 v72.62,20.27 | v132.13,12.98 132.66,12.45 132.66,7.49 131.27,6.15 111.63,6.15 110.34,7.44 S2.4
  Bottom 0.813: v53.92,7.85 52.6,9.17 v52.6,13.08 58.24,13.08 v58.29,13.03 | v87.4,14.33 87.32,14.4 v84.18,14.4
  Bottom 1.016: J1.1 80.54,46.94 77.14,46.94 76.68,46.48 | 76.68,46.48 76.22,46.03 v76.22,41.2 | v72.85,46.66 73.02,46.48 76.68,46.48 | HEAD_RELE.3 89.03,6.31 89.03,5.03 86.74,2.74 82.68,2.74 | 82.68,2.74 79.17,2.74 76.31,5.68 HEAD_LEVL.3 | HEAD_RUDDER.3 82.68,6.31 82.68,2.74
GPS_SCL
  Top 0.305: U$5.19_SCL2 23.89,10.85 23.89,9.63 | 23.89,9.63 R2.1 | U$3.6 21.36,7.75 20.78,8.33 20.78,9.17 21.23,9.63 23.89,9.63
GPS_SDA
  Top 0.305: R15.1 23.6,7.1 U$3.5 21.31,7.1 20.34,8.04 20.34,9.41 21.82,10.89 U$5.18_SDA2
GPS_WAKE
  Top 0.305: U$5.4_EXTINT0 26.11,22.89 26.11,26.95 30.38,31.24 51.56,31.22 55.27,27.51 63.22,27.48 64.36,28.63 70.79,28.63 72.62,26.8 72.62,25.71 73.45,24.85 STM32F401RBT6.3
JTCK
  Top 0.203: 88.61,30.3 87.55,30.3 87.22,30.63 87.22,35.31 87.55,35.58 | 85.57,27.96 85.55,27.99 85.55,28.93 86.11,29.49 87.88,29.49 88.62,30.23 R19.2
  Top 0.305: STM32F401RBT6.49 85.57,27.96 | R19.2 88.61,30.3 | 87.55,35.58 U$2.4
JTDI
  Top 0.203: 88.68,38.1 89.97,38.1 90.3,37.77 90.3,36.53 89.99,36.22 87.32,36.22 86.87,35.76 86.87,30.99 86.22,30.34 R22.1 | 85.06,30.04 STM32F401RBT6.50
  Top 0.305: U$2.8 88.68,38.1 | R22.1 85.06,30.04
JTDO
  Top 0.203: 83.52,29.85 83.06,29.38 82.56,28.88 STM32F401RBT6.55 | 83.52,30.71 83.8,30.99 86.03,30.99 86.51,31.5 86.51,36.07 87.3,36.86 U$2.6
  Top 0.305: 83.52,29.85 R21.1 83.52,30.71
JTMS
  Top 0.254: U$2.2 87.68,33.34 87.68,31.6 88.06,31.22 89.26,31.22 89.66,30.84 89.66,29.44 89.2,28.98 86.38,28.98 86.05,28.65 86.05,25.2 86.4,24.85 STM32F401RBT6.46
  Top 0.305: STM32F401RBT6.46 89.45,24.85 91.26,23.04 92.53,23.04 92.84,23.34 92.84,24.91 R20.1
JTRST
  Top 0.203: 88.63,39.37 87.12,39.37 86.11,38.35 86.11,31.72 85.78,31.37 83.16,31.37 82.55,30.76 82.55,29.74 82.06,29.26 STM32F401RBT6.56
  Top 0.305: U$2.10 88.63,39.37
N$1  (via drill 0.41)
  Top 0.254: R9.2 63.59,32.54 60.71,32.54 60.45,32.79 60.17,32.79 59.31,31.93 59.31,31.9 59.28,31.93 55.3,31.93
  Top 0.305: JP1.VBUS 95.76,6.77 95.61,6.91 95.12,7.4 95.12,14 U$6.5
  Top 0.813: 55.3,31.9 59.31,31.9 59.42,31.9 60.06,32.54 IC2.4
  Top 1.016: C5_MCP73831_4.1 63.5,34.91 C4_MCP73831_4.1 63.6,34.81 R9.2 60.66,32.52 IC2.4 | D3.A 55.63,35.53 55.04,34.95 55.04,32.13 55.07,32.13 55.3,31.9 | 55.3,31.93 55.07,31.7 v55.07,29.57 | v51.05,25.63 48.18,22.76 v48.18,16.46 | v95.3,6.55 95.61,6.71 95.61,6.91
  Bottom 1.016: v55.07,29.57 51.13,25.63 v51.05,25.63 | v48.18,16.46 48.21,16.43 48.21,11.94 49.4,10.74 49.4,6.63 52.93,3.1 69.8,3.1 71.81,1.09 89.84,1.09 v95.3,6.55
N$2  (via drill 0.41)
  Top 0.61: C21_MCP73831_VSS.2 57.85,34.91 57.3,34.37 57.3,34.34 v56.92,33.96
  Top 0.813: v50.24,34.01 v53.62,34.01 | v56.92,33.96 57.92,34.9 C21_MCP73831_VSS.2
  Bottom 0.813: J1.2 83.37,50.08 82.19,51.26 76.48,51.26 49.76,43.41 49.76,34.49 v50.24,34.01 | v53.62,34.01 56.87,34.01 v56.92,33.96
  Bottom 1.016: J1.2 83.39,47.78 83.39,50.39 84.02,51.03 86.49,51.03 87.12,50.39 87.12,45.8 87.76,45.16 94.11,45.16 95.83,43.43 95.86,37.29 97.33,35.84 S1.2
N$5
  Top 1.016: J$1.SIG 159.58,10.88 U$8.10
N$6  (via drill 0.6)
  other vias: 4.06,3.66 5.54,4.7 5.54,3.66
N$7  (via drill 0.6)
  other vias: 46.84,3.68 45.39,4.72 45.42,3.68 41.66,0.74 40.11,0.74
N$8  (via drill 0.6)
  other vias: 115.75,3.68 117.32,4.72 117.32,3.68
N$9  (via drill 0.6)
  other vias: 158.78,3.68 157.28,4.72 157.28,3.68
N$10  (via drill 0.6)
  other vias: 122.78,0.58 121.23,0.58
N$13  (via drill 0.6 pad 0.3)
  Top 0.406: Q1.2 60.26,40.4 60.27,40.41 60.05,40.41 59.87,40.59 57.56,40.59 D2.C
  Top 1.016: Q1.2 61.04,39.52 61.67,40.15 61.67,40.98 62.31,41.62 C9_LM2937_1.1 66.85,41.62 C8_LM2937_1.1 73.32,41.64 75.54,39.42 v75.54,36.91 | U1.1 70.84,36.91 v71.93,36.91
  Bottom 1.016: v71.93,36.91 v75.54,36.91
N$14
  Top 0.813: U$5.11_RF_IN 16.48,22.92 U$4.FEED
N$15  (via drill 0.3 pad 0.2)
  Top 0.305: SJ1.2 v84.76,37.31 | v81.18,36.09 81.16,36.07 U3.9
  Bottom 0.305: v84.76,37.31 84.45,37.01 81.74,37.01 81.18,36.45 v81.18,36.09
N$16
  Top 0.305: JP1.D+ 97.66,6.79 R8.2
N$17
  Top 0.305: JP1.D- 96.88,6.78 96.9,8.53 96.24,9.2 R7.2
N$18
  Top 0.305: C1_MPU_10.1 81.66,32.24 U3.10
N$19
  Top 0.254: R4.1 60.15,34.85 59.33,34.04 59.07,34.04 IC2.5
N$21
  Top 0.254: 76.89,34.04 77.49,34.65 77.49,38.53 78.41,39.45
  Top 0.305: U3.20 82.14,38.26 82.14,39.04 81.74,39.45 78.41,39.45 | C2_MPU_20.1 75.52,34.04 76.89,34.04
N$22
  Top 0.813: 63.6,29.16 R9.1
  Top 1.016: LED1.A 62.97,28.52 63.6,29.16
N$23
  Top 0.305: 57.91,30 58.16,30.24 IC2.1
  Top 1.016: LED1.C 57.91,28.79 57.91,30
N$24
  Top 0.305: JP3.D+ 8.33,17.96 8.51,17.93 9.03,17.42 U$1.1 9.54,15.04 R10.1
N$25
  Top 0.254: R11.1 9.86,12.95 10.9,14 10.9,16.03 11.44,16.42 U$1.3
  Top 0.305: JP3.D- 6.88,18.75 8.59,18.75 9.37,17.98 11.02,17.98 11.48,17.55 11.48,16.95 U$1.3
N$26
  Top 0.305: R10.2 14.85,18.59 21.97,18.59 23.92,20.57 U$5.6_USB_DP
N$27
  Top 0.305: R11.2 16.32,17.93 21.95,17.93 25.02,21.01 U$5.5_USB_DM
N$28
  Top 0.305: JP3.VBUS 8.04,20.73 9.75,20.73 10.49,19.99 | 10.49,19.99 U$1.5 10.49,18.82 10.82,18.44 12.62,18.44 13.44,19.25 19.19,19.25 U$5.7_VDDUSB | C6_USB_VBUS.2 12.63,19.99 10.49,19.99
N$30
  Top 0.305: U$5.9_VCC_RF U$5.8_RESERVED
N$31  (via drill 0.3 pad 0.2)
  Top 0.305: STM32F401RBT6.60 80.06,28.73 79.7,29.08 v79.65,29.08 | v76.45,28.73 76.4,28.78 R12.1
  Bottom 0.305: v79.65,29.08 79.6,29.03 76.71,29.03 76.45,28.78 v76.45,28.73
NRST  (via drill 0.3)
  Top 0.254: R13.1 106.86,10.98 106.86,9.35 105.87,8.36 105.84,8.36 S2.2 | 105.82,5.05 105.79,3.35 88.52,3.35 87.53,2.39 75.36,2.39 71.63,6.12 v71.63,6.45 | v69.49,17.75 69.49,21.08 71.26,22.85 STM32F401RBT6.7
  Top 0.305: C7_RESET_DEBOUNCE.1 R13.1 106.86,9.36 S2.2 105.82,5.05 S2.1
  Bottom 0.254: v71.63,6.45 71.63,11.25 69.49,13.39 v69.49,17.75
RFM_DI0  (via drill 0.3)
  Top 0.254: STM32F401RBT6.33 88.64,18.35
  Top 0.305: 88.64,18.35 v88.75,18.26 | v105.64,18.01 105.66,18.01 107.77,20.09 107.77,27.53 109.8,29.57 128.78,29.57 v129.08,29.26 | v132.69,20.9 134.86,20.9 U$8.2
  Bottom 0.305: v88.75,18.26 88.88,18.34 89.2,18.01 101.88,18.01 101.88,17.65 102.92,16.61 104.57,16.61 105.64,17.68 v105.64,18.01 | v129.08,29.26 130.45,29.26 131.62,28.09 131.62,21.97 v132.69,20.9
RFM_MISO  (via drill 0.3)
  Top 0.254: STM32F401RBT6.35 89.81,19.35 v89.92,19.46
  Top 0.305: v104.72,19.58 104.72,19.46 106.32,21.08 106.3,27.89 109.52,31.11 v129.08,31.09 | v132.54,31.09 145.57,31.11 150.83,25.86 151.69,25.02 154.79,25.02 156.74,23.06 156.74,20.57 156.03,19.86 153.11,19.86 152.86,19.61 152.86,17.17 153.14,16.89 154.57,16.89 U$8.13
  Bottom 0.305: v89.92,19.46 104.62,19.48 v104.72,19.58 | v129.08,31.09 v132.54,31.09
RFM_MOSI  (via drill 0.3)
  Top 0.305: STM32F401RBT6.36 89.11,19.85 v89.43,20.17 | v103.58,20.19 104.44,20.19 105.71,21.44 105.71,28.12 109.27,31.67 128.75,31.67 v129.08,31.83 | v132.54,31.83 145.8,31.83 151.49,26.14 154.84,26.14 157.84,23.14 157.84,19.51 157.18,18.85 154.62,18.85 U$8.14
  Bottom 0.305: v89.43,20.17 v103.58,20.19 | v129.08,31.83 v132.54,31.83
RFM_NSS  (via drill 0.3, 0.41)
  Top 0.254: STM32F401RBT6.62 79.07,26.31 78.87,26.11 v78.87,25.5 | v87.71,26.47 88.14,26.9 v91.26,26.9 | v133.07,33.45 133.1,33.43 146.28,33.43 152.07,27.64 155.4,27.64 159.26,23.77 v159.26,20.88 | v152.65,20.88 v152.66,20.88 U$8.15
  Bottom 0.254: v78.87,25.5 80.34,25.5 80.85,24.99 81.66,24.99 81.84,25.17 81.84,26.42 81.89,26.47 v87.71,26.47 | v91.26,26.9 100.89,26.9 104.9,30.91 126.21,30.91 126.92,31.62 126.92,32.61 127.76,33.45 v133.07,33.45 | v159.26,20.88 v152.65,20.88
RFM_RST  (via drill 0.3)
  Top 0.254: STM32F401RBT6.34 89.25,18.85 v89.43,18.75
  Top 0.305: v104.83,18.8 105.1,18.8 107.09,20.8 107.11,27.79 109.73,30.4 129.11,30.35 v129.08,30.3 | v132.61,24.89 132.61,23 C14_RFM69_1.1
  Top 1.016: U$8.1 134.06,22.87 C14_RFM69_1.1
  Bottom 0.305: v89.43,18.75 102.62,18.8 102.79,18.97 104.16,18.97 104.34,18.8 v104.83,18.8 | v129.08,30.3 131.8,30.3 132.59,29.52 132.59,24.92 v132.61,24.89
RFM_SCK  (via drill 0.3)
  Top 0.305: U$8.12 157.05,14.88 158.55,16.38 158.55,23.34 154.94,26.95 151.87,26.95 146.15,32.66 132.59,32.66 v132.56,32.64 | v127.74,28.96 110.31,28.96 108.66,27.31 108.66,19.46 106.58,17.35 v106.53,17.35 | v84.05,17.91 84.06,17.85 STM32F401RBT6.29
  Bottom 0.305: v132.56,32.64 128.25,32.64 127.74,32.13 v127.74,28.96 | v106.53,17.35 105.28,16.1 102.59,16.1 101.35,17.35 96.47,17.35 95.4,16.28 86.87,16.28 85.8,17.35 84.61,17.35 v84.05,17.91
SCL  (via drill 0.3 pad 0.2)
  Top 0.254: 78.61,38.94 77.9,38.23 77.9,33 77.19,32.28 | 90.93,19.33 89.2,17.6 88.37,17.6 88.04,17.93 86.33,17.93
  Top 0.305: U3.23 80.67,38.26 80.67,38.84 80.57,38.94 78.61,38.94 | 77.19,32.28 76.61,32.28 | 76.61,32.28 R5.2 | v81.51,29.11 81.05,28.65 81.05,27.81 STM32F401RBT6.58 81.06,23.2 86.33,17.93 | v76.56,31.52 76.61,31.57 76.61,32.28 | IC1.8 92.48,17.42 92.81,17.75 92.81,18.77 92.25,19.33 90.93,19.33
  Bottom 0.305: v81.51,29.11 81.51,29.69 80.72,30.48 77.6,30.48 v76.56,31.52
SD_DETECT  (via drill 0.3)
  Top 0.254: STM32F401RBT6.2 76.11,25.38 73.86,25.38 v73.38,25.86 | v52.32,24.38 49.66,21.72 v49.66,15.98 | v49.66,13.82 49.66,8.91 50.78,7.8 50.78,2.14 U2.GND3
  Bottom 0.254: v73.38,25.86 53.8,25.86 v52.32,24.38 | v49.66,15.98 v49.66,13.82
SDA  (via drill 0.3 pad 0.2, 0.3 pad 0.3)
  Top 0.254: 78.79,38.46 78.28,37.95 78.28,31.95
  Top 0.305: U3.24 79.95,38.46 78.79,38.46 | 78.28,31.95 76.89,30.56 | 76.89,30.56 R6.2 | v80.57,29.26 STM32F401RBT6.59 80.56,23.73 80.57,22.96 86.03,17.5 87.66,17.5 88.01,17.14 89.85,17.14 IC1.7 | v76.89,29.69 76.89,30.56
  Bottom 0.305: v80.57,29.26 80.14,29.69 v76.89,29.69
SDIO_CLK  (via drill 0.3 pad 0.2, 0.3 pad 0.3)
  Top 0.305: STM32F401RBT6.53 83.57,26.21 83.31,25.96 83.31,24.41 v82.83,23.93 | v59.26,24.11 58.47,24.92 56.06,24.92 55.45,24.31 55.47,6.68 55.04,6.24 U2.5
  Bottom 0.305: v82.83,23.93 82.5,23.6 80.09,23.6 79.55,24.13 v59.26,24.11
SDIO_CMD  (via drill 0.3 pad 0.3)
  Top 0.305: U2.3 57.23,9.14 56.49,9.88 R1.2 56.95,16.88 57.58,17.52 v57.58,23.39 | v82.47,25.83 83.06,26.42 STM32F401RBT6.54
  Bottom 0.305: v57.58,23.39 57.58,24.03 58.42,24.87 80.03,24.87 80.72,24.18 81.76,24.18 82.47,24.89 v82.47,25.83
SDIO_D0  (via drill 0.3)
  Top 0.254: STM32F401RBT6.39 87.5,21.36 85.37,21.36 84.91,20.9 v84.35,20.9 | v54.48,17.73 R17.2
  Top 0.305: U2.7 52.88,4.87 52.88,8.69 54.3,10.11 54.3,16.25 R17.2 54.25,16.8 54.46,16.94
  Bottom 0.254: v84.35,20.9 84.3,20.83 79.12,20.83 79.07,20.88 55.63,20.88 55.42,20.68 51.26,20.68 50.93,20.35 50.93,18.06 51.26,17.73 v54.48,17.73
SDIO_D1  (via drill 0.3 pad 0.3)
  Top 0.254: R18.2 52.85,16.99 53.06,16.99 53.77,16.28 53.8,10.34 51.73,8.28 U2.8
  Top 0.305: R18.2 52.47,16.88 53.26,17.68 53.26,20.6 v54,21.34 | v83.77,21.49 84.45,21.49 84.99,21.87 87.49,21.87 STM32F401RBT6.40
  Bottom 0.305: v54,21.34 v83.77,21.49
SDIO_D2  (via drill 0.3 pad 0.3)
  Top 0.305: U2.1 60.94,6.32 R16.2 61.77,16.93 61.95,17.11 61.95,19.61 61.19,20.37 v61.19,22.15 | v84.56,25.12 84.56,25.14 STM32F401RBT6.51
  Bottom 0.305: v61.19,22.15 83.74,22.15 84.56,22.96 v84.56,25.12
SDIO_D3  (via drill 0.3 pad 0.3)
  Top 0.305: U2.2 58.34,9.49 59.79,10.95 59.79,16.19 R3.2 59.84,18.12 v59.84,22.48 | STM32F401RBT6.52 84.07,27.79 84.07,26.06 83.77,25.76 83.77,23.37 83.26,22.86 v82.63,22.86
  Bottom 0.305: v82.63,22.86 78.84,22.86 78.54,23.17 60.53,23.17 v59.84,22.48
TIM3_CH1  (via drill 0.3)
  Top 0.254: STM32F401RBT6.37 84.96,20.35 v84.81,20.32
  Bottom 0.254: v84.81,20.32 84.78,20.22 82.14,20.22 80.85,18.92 79.96,18.92 79.7,18.67 77.83,18.67 77.6,18.9 77.6,18.92 65.66,18.92 63.65,16.92 51.11,16.92 50.04,17.98 50.04,27.2 45.59,31.65 39.88,31.65 39.52,32.01 HEAD_LAIL.1
TIM3_CH2  (via drill 0.3)
  Top 0.305: HEAD_RAIL.1 109.52,33 104.72,28.2 104.72,21.59 103.99,20.85 v103,20.85 | v90.02,20.85 STM32F401RBT6.38
  Bottom 0.305: v103,20.85 v90.02,20.85
TIM3_CH3
  Top 0.305: HEAD_RELE.1 85.67,7.16 85.67,8.31 84.12,9.86 83.03,9.86 82.56,10.32 STM32F401RBT6.26
TIM3_CH4  (via drill 0.3)
  Top 0.254: v78.38,9.7 79.2,8.89 v80.97,8.89 | v85.42,9.6 84.63,10.39 83.64,10.39 83.06,10.97 STM32F401RBT6.27
  Bottom 0.254: HEAD_LEVL.1 72.44,7.7 72.44,10.39 72.97,10.92 73.63,10.92 74.85,9.7 v78.38,9.7 | v80.97,8.89 81.69,9.6 v85.42,9.6
TIM4_CH3  (via drill 0.3 pad 0.3)
  Top 0.305: STM32F401RBT6.61 79.58,27.78 79.58,22.38 80.21,21.74 80.8,21.74 81.25,21.29 v81.25,18.49
  Bottom 0.305: v81.25,18.49 80.79,18.49 80.16,17.86 HEAD_RUDDER.1
TIMEPULSE
  Top 0.305: U$5.3_TIMEPULSE 27.25,22.92 27.25,26.8 30.81,30.38 50.8,30.38 54.25,26.92 63.48,26.92 64.72,28.17 70.46,28.17 72.06,26.57 72.06,25.35 73.06,24.35 STM32F401RBT6.4
USART1_RX
  Top 0.305: STM32F401RBT6.43 87.54,23.32 89.76,23.32 90.47,22.61 95.71,22.61 96.67,21.64 JP2.3
USART1_TX
  Top 0.305: JP2.2 96.98,19.1 95.4,20.68 95.4,21.74 95.05,22.1 89.97,22.1 89.22,22.85 STM32F401RBT6.42
USART2_RX  (via drill 0.3 pad 0.3)
  Top 0.305: U$5.20_TXD1 25.17,11.03 25.17,13.72 30.3,18.85 30.3,28.12 31.45,29.26 50.65,29.26 53.67,26.24 61.75,26.24 62.97,25.02 62.97,19.71 68.25,14.43 71.78,14.43 72.16,14.05 v72.16,12.47 | v77.19,12.47 77.2,15.53 STM32F401RBT6.17
  Bottom 0.305: v72.16,12.47 v77.19,12.47
USART2_TX  (via drill 0.3 pad 0.3)
  Top 0.305: 75.89,18.34 75.9,18.35 STM32F401RBT6.16 76.11,13.55 v76.07,13.51 | U$5.21_RXD1 26.11,10.89 26.11,13.21 31.17,18.26 31.17,27.94 31.83,28.6 50.27,28.6 53.37,25.5 61.7,25.5 62.46,24.79 62.46,19.33 68.33,13.51 v71.5,13.51
  Bottom 0.305: v71.5,13.51 v76.07,13.51
USB_DM  (via drill 0.3, 0.41)
  Top 0.254: STM32F401RBT6.44 86.31,23.85 85.9,23.44 v85.9,22.68 | v90.7,16.92 90.75,16.92 91.67,16 94.64,16 94.84,16.21 95.94,16.21 96.57,15.57 97,15.57 97.05,15.52 97.05,13.51 97.52,13.05 U$6.1
  Top 0.305: R7.1 96.19,11.01 96.19,11.91 96.49,12.22 97.18,12.22 98.01,13.05 U$6.1
  Bottom 0.254: v85.9,22.68 85.9,18.62 86.74,17.78 87.86,17.78 88.72,16.92 v90.7,16.92
USB_DP  (via drill 0.3)
  Top 0.254: STM32F401RBT6.45 87.5,24.33 85.22,24.33 84.99,24.11 v84.99,22.53 | v87.27,16.92 87.66,16.59 87.66,15.88 87.96,15.57 v95.27,15.57 | U$6.3 98.44,14.94 v100.08,14.94
  Top 0.305: R8.1 98.92,12.27 99.24,12.27 99.47,12.5 99.47,14.94 99.46,14.95 U$6.3
  Bottom 0.254: v84.99,22.53 85.37,22.02 85.37,18.49 86.94,16.94 v87.27,16.92 | v100.08,14.94 98.88,16.13 96.37,16.13 95.78,15.57 v95.27,15.57
VDD  (via drill 0.3, 0.41, 0.6, 0.6 pad 0.3)
  Top 0.203: 101.78,17.91 96.39,17.91 95.91,17.43 IC1.1 | C17_STM32_32.2 86.51,13.32 86.51,15.77 85.89,16.4 STM32F401RBT6.32
  Top 0.254: C3_MPU_3.1 78.74,32.85 78.74,36.3 78.94,36.5 U3.3 | C16_STM32_13.1 70.81,17.79 v70.81,19.58 | v78.26,19.43 77.24,19.43 76.82,19.85 STM32F401RBT6.13 | v79.96,19.53 79.96,19.43 79.07,18.54 STM32F401RBT6.19 79.06,14.67 C20_STM32_19.2 | U3.8 80.64,34.23 v80.64,33.17 | 84.91,32.61 85.14,32.39 R22.2 84.91,32.37 84.91,32.61 | 91.94,21.4 91.8,21.54 v88.77,21.54 | v90.68,24.97 90.09,25.55 90.09,25.85 | 85.89,16.4 87.2,15.09 93.95,15.09 94.31,14.73 | 102.61,13.2 102.61,13.43 | 84.91,32.61 v84.3,33.22
  Top 0.305: 25.72,8.99 R2.2 25.69,8.72 25.09,8.13 23.37,8.13 23.06,8.43 23.06,8.79 22.81,9.04 U$3.8 | 25.72,8.99 R15.2 | 25.72,8.99 27.69,8.99 28.32,9.63 U$5.23_VCC | C16_STM32_13.1 71.02,17.59 | U3.8 80.66,33.35 C3_MPU_3.1 79.41,32.14 78.05,30.79 78.05,27.81 STM32F401RBT6.64 77.19,26.92 C19_STM32_64.2 75.26,26.92 74.62,27.56 74.62,29.63 R6.1 73.67,30.58 R5.1 | R21.2 83.52,34.89 U3.13 85.01,35 85.57,35.56 SJ1.1 | U$2.1 92.61,34.26 v92.61,33.07 92.61,30.89 92.06,30.34 C22_JTAG_VCC.2 91.94,29.36 C18_STM32_48.2 R20.2 | R20.2 91.89,25.85 90.09,25.85 STM32F401RBT6.48 | 92.2,23.57 91.99,23.57 C15_MS5611_1.2 R20.2 | IC1.1 IC1.2 93.92,18.68 93.02,19.58 93.02,20.4 93.75,21.13 94.07,21.13 IC1.4 IC1.5 91.94,21.4
  Top 0.813: C17_STM32_32.2 87.76,10.25 HEAD_RELE.2 | U2.4 56.13,4.62 56.13,3.53 56.64,3.02 63.91,3.02 71.02,10.14 v73.3,10.14 73,10.44 73,15.52 72.16,16.36 71.3,16.36 70.83,16.83 C16_STM32_13.1 | R18.1 v52.3,19.74 | v60.68,19.74 60.94,19.48 R16.1 | R17.1 54.38,18.73 v54.38,19.74 | R1.1 56.46,18.71 v56.46,19.74 | R3.1 58.57,18.76 v58.57,19.74 | 94.31,14.73 v95.12,14.73 | v101.83,12.42 102.61,13.2
  Top 1.016: R21.2 R22.2 | U1.3 66.19,37.94 66.83,38.57 C10_LM2937_3.1 70.48,38.57 C11_LM2937_3.1 71.9,38.55 v71.91,38.56 | HEAD_LAIL.2 40.77,35.18 44.12,38.53 v54.18,38.53 54.18,42.95 56.19,44.96 97.74,44.96 101.79,40.91 | HEAD_RAIL.2 122.02,33.03 122.02,35.69 117.35,40.39 102.26,40.39 101.79,40.91 | 101.79,40.91 101.79,24.6 101.37,24.18 JP2.4 101.78,24.18 101.78,17.91 101.78,14.26 | HEAD_LEVL.2 75.06,4.32 75.69,3.71 JP4.8 | R13.2 102.61,13.43 101.78,14.26 | U$8.8 134.04,8.96 C12_RFM69_8.1 | C12_RFM69_8.1 C13_RFM69_8.1 | C12_RFM69_8.1 132.54,8.9 132.54,7.64 131.55,6.66 114.22,6.68 112.37,8.48 112.37,11.76 109.87,14.26 101.78,14.26 | U$5.23_VCC 28.32,13.41 32.87,17.96 v32.87,22.96
  Bottom 0.254: v79.96,19.53 79.86,19.43 v78.26,19.43 77.29,19.43 76.89,19.84 73.48,19.84 73.23,19.58 v70.81,19.58 70.66,19.74 v60.68,19.74 | v80.64,33.17 80.7,33.22 v84.3,33.22 85.37,33.22 85.52,33.07 v92.61,33.07 | v88.77,21.54 90.68,23.44 v90.68,24.97
  Bottom 0.813: v73.3,10.14 75.06,8.38 75.06,6.88 | v52.3,19.74 v54.38,19.74 v56.46,19.74 v58.57,19.74 v60.68,19.74 | v95.12,14.73 97.43,12.42 v101.83,12.42
  Bottom 1.016: v54.18,38.53 54.2,38.56 v71.91,38.56 | HEAD_RELE.2 87.76,7.95 87.17,8.53 82.42,8.53 81.41,7.52 HEAD_RUDDER.2 81.41,4.78 80.97,4.34 79.81,4.34 78.16,5.99 78.16,7.9 77.65,8.41 76.15,8.41 75.06,7.32 75.06,6.88 HEAD_LEVL.2 | v32.87,22.96 32.26,23.57 32.26,31.98 35.69,35.41 39.4,35.41 40.77,34.04 HEAD_LAIL.2